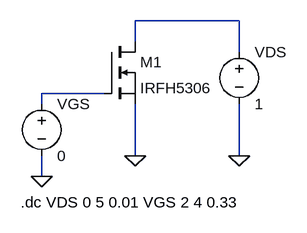
[diagram p0: schematic MOS_output.asc]
MOS_output.asc, the LTspice schematic file:
Version 4
SHEET 1 880 680
WIRE 320 80 160 80
WIRE 160 112 160 80
WIRE 320 128 320 80
WIRE 112 192 16 192
WIRE 16 208 16 192
WIRE 160 288 160 208
WIRE 320 288 320 208
WIRE 16 320 16 288
FLAG 16 320 0
FLAG 160 288 0
FLAG 320 288 0
SYMBOL voltage 16 192 R0
WINDOW 123 0 0 Left 0
WINDOW 39 0 0 Left 0
SYMATTR InstName VGS
SYMATTR Value 0
SYMBOL voltage 320 112 R0
WINDOW 123 0 0 Left 0
WINDOW 39 0 0 Left 0
SYMATTR InstName VDS
SYMATTR Value 1
SYMBOL nmos 112 112 R0
SYMATTR InstName M1
SYMATTR Value IRFH5306
TEXT -16 360 Left 2 !.dc VDS 0 5 0.01 VGS 2 4 0.33

The netlist it stands for:
* MOS_output.asc
VGS N002 0 0
VDS N001 0 1
M1 N001 N002 0 0 IRFH5306
.model NMOS NMOS
.model PMOS PMOS
.lib standard.mos
.dc VDS 0 5 0.01 VGS 2 4 0.33
.backanno
.end